# Altium schematic sheet SR.SchDoc
size A4; SheetNumber: 9; SheetTotal: 12
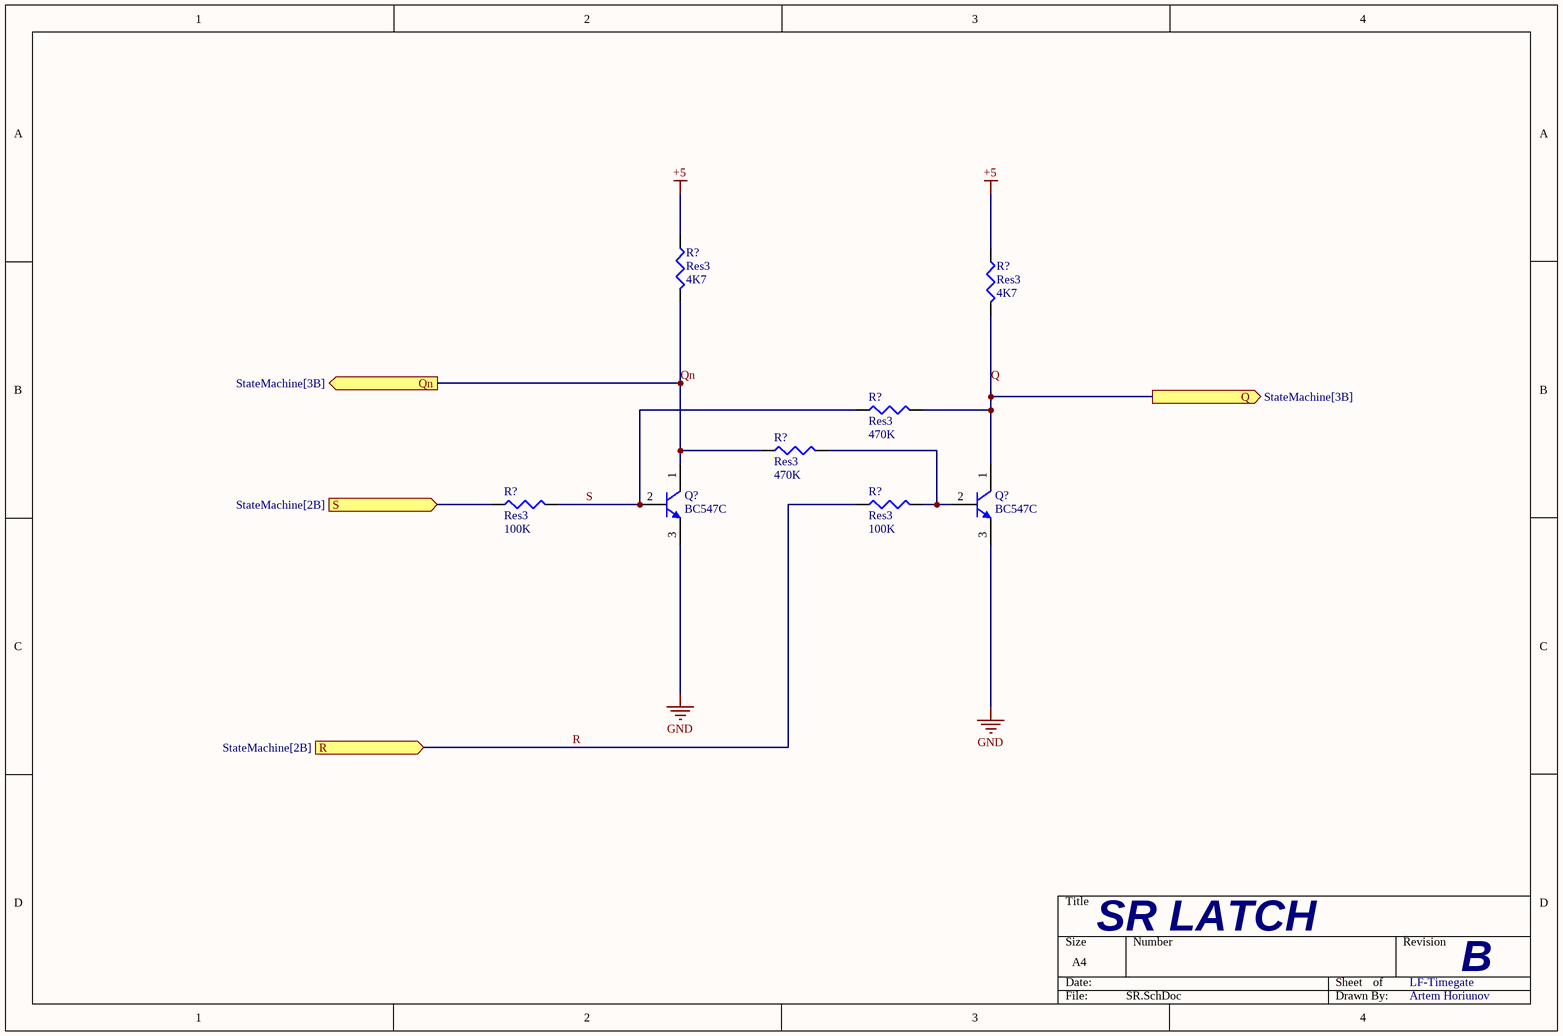
[diagram p0: SR.SchDoc]

## Parts
(Parts that share a designator on the sheet are numbered #1, #2 ... from top to bottom, then left to right.)
Q?#1  BC547C  [ONSC-TO-92-3-29-11]
Q?#2  BC547C  [ONSC-TO-92-3-29-11]
R?#1  Res3  value 4K7  [J1-0603]
R?#2  Res3  value 4K7  [J1-0603]
R?#3  Res3  value 470K  [J1-0603]
R?#4  Res3  value 470K  [J1-0603]
R?#5  Res3  value 100K  [J1-0603]
R?#6  Res3  value 100K  [J1-0603]

## Ports
Q (out, see StateMachine[3B]), Qn (out, see StateMachine[3B]), R (in, see StateMachine[2B]), S (in, see StateMachine[2B])

## Nets
+5: R?#1.1 R?#2.1
GND: Q?#1.3(E) Q?#2.3(E)
Q: Q?#2.1(C) R?#2.2 R?#3.2 ; port Q
Qn: Q?#1.1(C) R?#1.2 R?#4.1 ; port Qn
R: R?#6.1 ; port R
S: Q?#1.2(B) R?#3.1 R?#5.2
S: R?#5.1 ; port S  [a separate net that carries the same name]
NetQ?#2_2: Q?#2.2(B) R?#4.2 R?#6.2

## Notes on the sheet
- SR LATCH
- LF-Timegate
- B
- Artem Horiunov

## Library data of the parts
Q?#1 Q?#2 = CMP-1048-01437-1: Amplifier Transistor, NPN Silicon, 3-Pin TO-92, Bulk Box; Manufacturer: On Semiconductor; IC Continuous (A): 0.1; fT Min (MHz): 150; Mounting Technology: Through Hole; ComponentLink1URL: http://www.onsemi.com/; ComponentLink1Description: Manufacturer URL; ComponentLink3URL: http://www.onsemi.cn/pub_link/Collateral/2N6426-D.PDF; DatasheetVersion: Rev. 7; PackageVersion: Rev. AM; Packing: Bulk Box; RoHS: FALSE; Polarity: NPN; PartNumber: BC547C; ComponentLink2URL: http://www.onsemi.com/pub_link/Collateral/BC546-D.PDF; ComponentLink3Description: Package Specification; PackageDescription: 3-Pin Transistor Outline, Body 4.825 x 3.685 mm, Pitch 1.27 mm; PackageReference: TO-92-3-29-11_AM_SL; ComponentLink2Description: Datasheet
R?#1-R?#6 = Res3: Resistor; Published: 8-Jun-2000; LatestRevisionDate: 29-May-2009; LatestRevisionNote: IPC-7351 Footprint Added.; PackageReference: J1-0603; Publisher: Altium Limited; PackageDescription: Chip Resistor